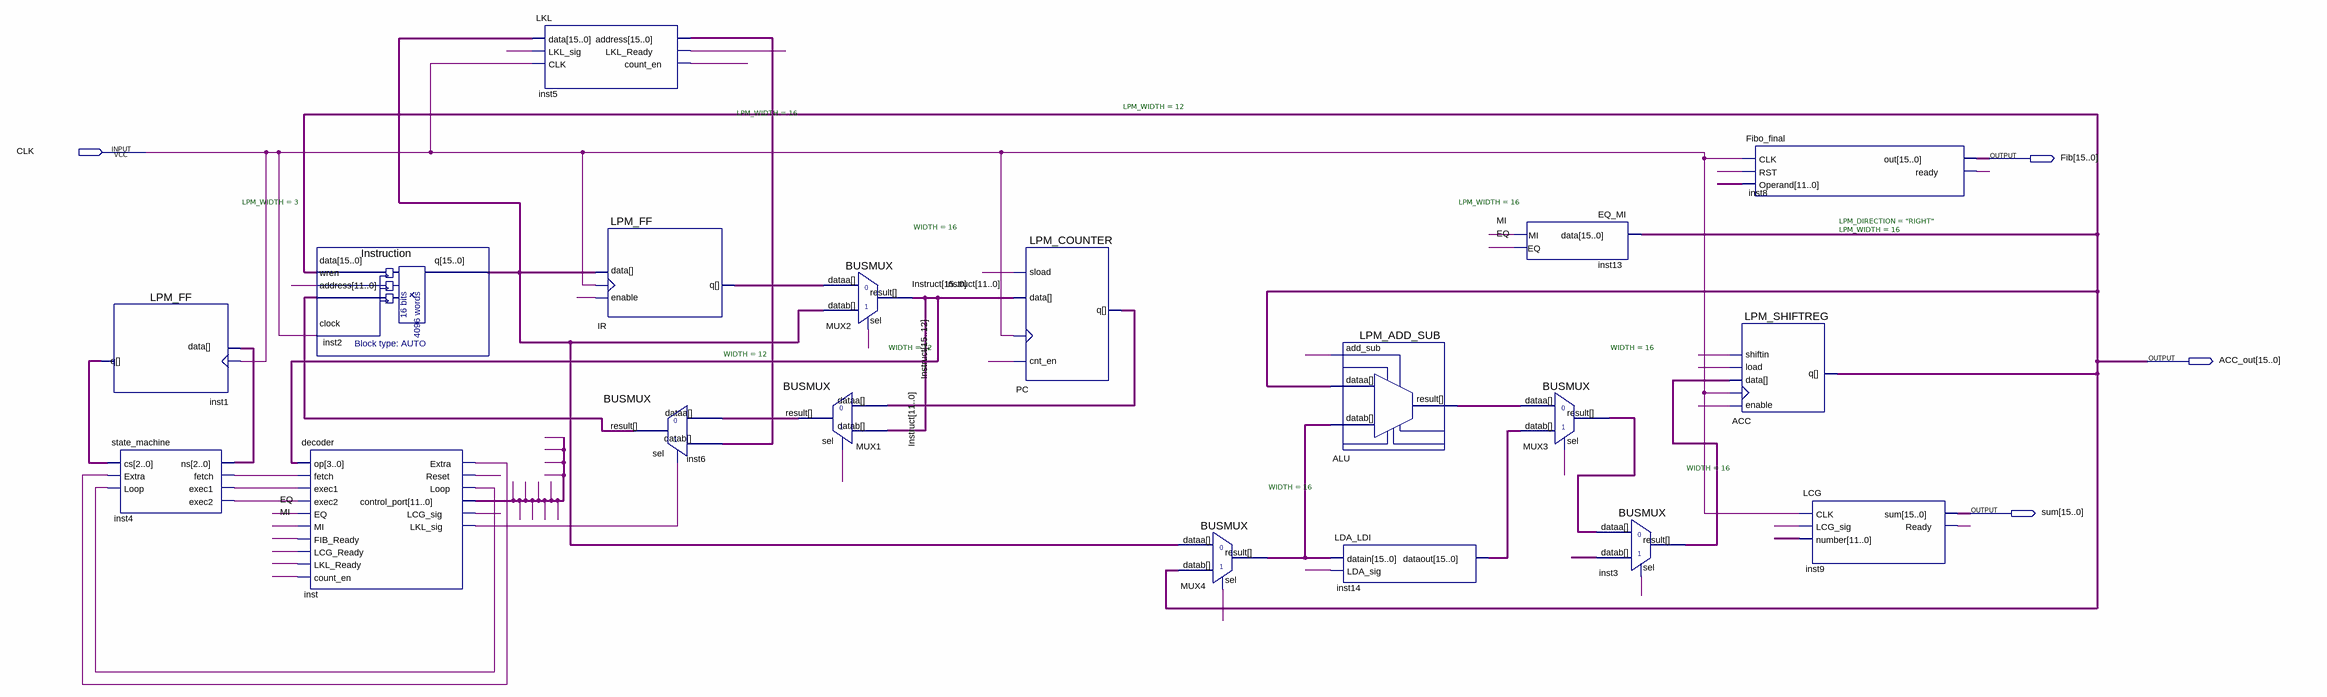
[diagram p0: schematic sheet]
// Quartus schematic Kirin_A15Plus.bdf as structural Verilog: 19 symbols, 4 pins
module Kirin_A15Plus (
  input  CLK,
  output [15:0] Fib,
  output [15:0] ACC_out,
  output [15:0] sum
);

  wire count_en, EQ, FIB_Ready, inst4_exec1, inst4_exec2, inst4_fetch, inst_extra, inst_loop, LCG_Ready,
       LCG_sig, LKL_Ready, LKL_sig, MI, Reset;
  wire [2:0] inst1_q, inst4_ns;
  wire [11:0] Control, inst6_result, MUX1_result, PC_q;
  wire [15:0] address, ALU_result, inst2_q, inst3_result, inst14_dataout, Instruct, IR_q, MUX3_result,
       MUX4_result;

  LPM_FF #(.LPM_WIDTH(3)) inst1 (.clock(CLK), .data(inst4_ns), .q(inst1_q));
  state_machine inst4 (
    .cs(inst1_q), .Extra(inst_extra), .Loop(inst_loop), .ns(inst4_ns), .fetch(inst4_fetch),
    .exec1(inst4_exec1), .exec2(inst4_exec2));
  Instruction inst2 (.data(ACC_out), .wren(Control[0]), .address(inst6_result), .clock(CLK), .q(inst2_q));
  decoder inst (
    .op(Instruct[15:12]), .fetch(inst4_fetch), .exec1(inst4_exec1), .exec2(inst4_exec2), .EQ(EQ), .MI(MI),
    .FIB_Ready(FIB_Ready), .LCG_Ready(LCG_Ready), .LKL_Ready(LKL_Ready), .count_en(count_en),
    .Extra(inst_extra), .Reset(Reset), .Loop(inst_loop), .control_port(Control), .LCG_sig(LCG_sig),
    .LKL_sig(LKL_sig));
  LKL inst5 (
    .data(inst2_q), .LKL_sig(LKL_sig), .CLK(CLK), .address(address), .LKL_Ready(LKL_Ready),
    .count_en(count_en));
  LPM_FF #(.LPM_WIDTH(16)) IR (.clock(CLK), .data(inst2_q), .enable(Control[1]), .q(IR_q));
  BUSMUX #(.WIDTH(12)) inst6 (.datab(address[11:0]), .sel(LKL_sig), .dataa(MUX1_result), .result(inst6_result));
  BUSMUX #(.WIDTH(16)) MUX2 (.datab(inst2_q), .sel(Control[1]), .dataa(IR_q), .result(Instruct));
  BUSMUX #(.WIDTH(12)) MUX1 (.datab(Instruct[11:0]), .sel(Control[8]), .dataa(PC_q), .result(MUX1_result));
  LPM_COUNTER #(.LPM_WIDTH(12)) PC (
    .clock(CLK), .cnt_en(Control[2]), .data(Instruct[11:0]), .sload(Control[3]), .q(PC_q));
  BUSMUX #(.WIDTH(16)) MUX4 (.datab(ACC_out), .sel(Control[9]), .dataa(inst2_q), .result(MUX4_result));
  LPM_ADD_SUB #(.LPM_WIDTH(16)) ALU (.add_sub(Control[4]), .dataa(ACC_out), .datab(MUX4_result), .result(ALU_result));
  LDA_LDI inst14 (.datain(MUX4_result), .LDA_sig(Control[11]), .dataout(inst14_dataout));
  EQ_MI inst13 (.data(ACC_out), .MI(MI), .EQ(EQ));
  BUSMUX #(.WIDTH(16)) MUX3 (.datab(inst14_dataout), .sel(Control[10]), .dataa(ALU_result), .result(MUX3_result));
  BUSMUX #(.WIDTH(16)) inst3 (.datab(address), .sel(LKL_Ready), .dataa(MUX3_result), .result(inst3_result));
  LPM_SHIFTREG #(.LPM_DIRECTION("RIGHT"), .LPM_WIDTH(16)) ACC (
    .clock(CLK), .data(inst3_result), .enable(Control[5]), .load(Control[7]), .shiftin(Control[6]),
    .q(ACC_out));
  Fibo_final inst8 (.CLK(CLK), .RST(Reset), .Operand(Instruct[11:0]), .out(Fib), .ready(FIB_Ready));
  LCG inst9 (.CLK(CLK), .LCG_sig(LCG_sig), .number(Instruct[11:0]), .sum(sum), .Ready(LCG_Ready));
endmodule
